# EAGLE design Cree 4x4 Led Panel (EAGLE 7.6.0)
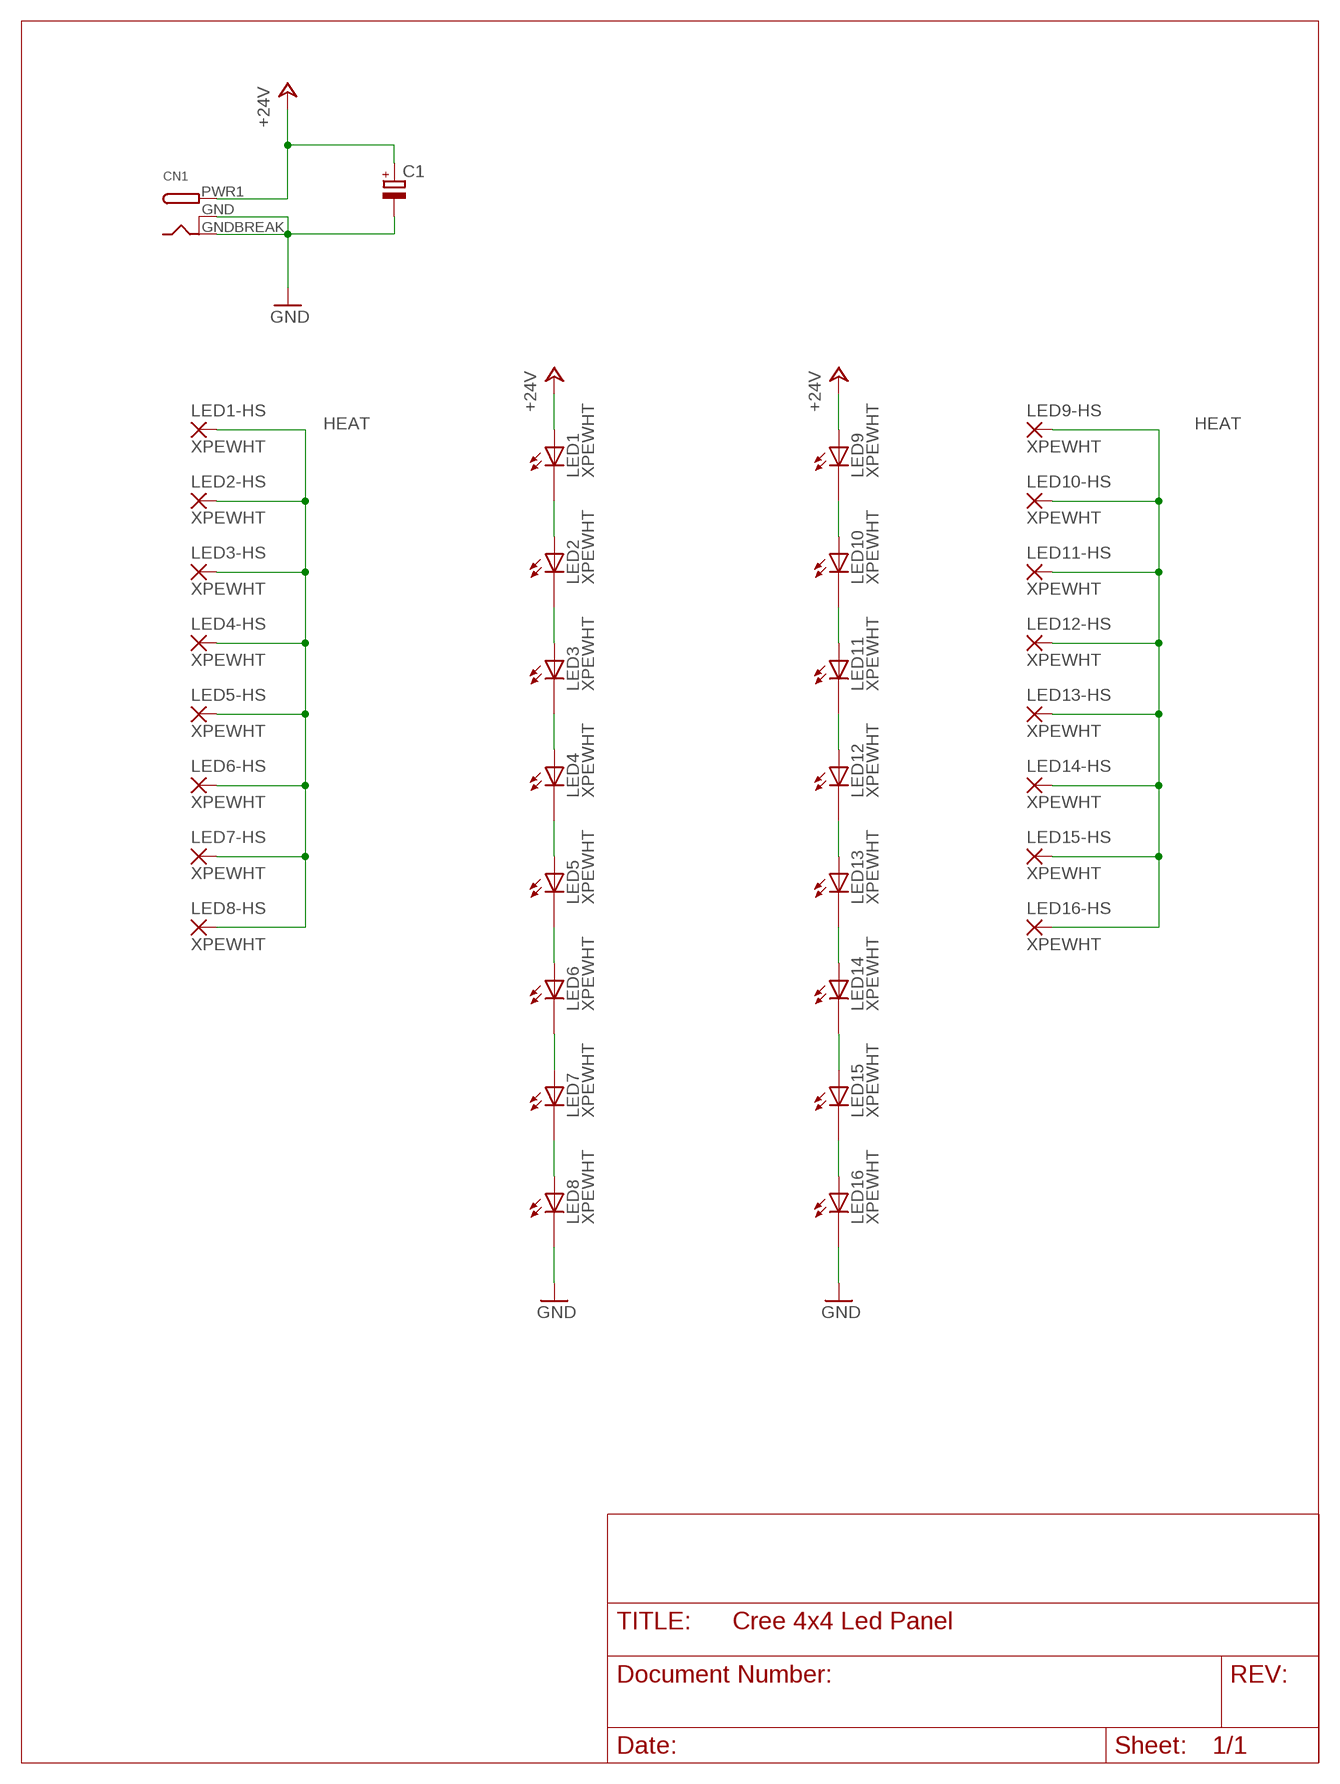
[diagram p0: schematic, sheet 1]

## Parts
C1  CPOL-EUSMCC  [SMC_C]
CN1  DCBARRELSMT  [DCJACK_2MM_SMT]
LED1  XPEWHT  XPEWHT-01-0000-00BC2  [CREE_XLAMP]
LED2  XPEWHT  XPEWHT-01-0000-00BC2  [CREE_XLAMP]
LED3  XPEWHT  XPEWHT-01-0000-00BC2  [CREE_XLAMP]
LED4  XPEWHT  XPEWHT-01-0000-00BC2  [CREE_XLAMP]
LED5  XPEWHT  XPEWHT-01-0000-00BC2  [CREE_XLAMP]
LED6  XPEWHT  XPEWHT-01-0000-00BC2  [CREE_XLAMP]
LED7  XPEWHT  XPEWHT-01-0000-00BC2  [CREE_XLAMP]
LED8  XPEWHT  XPEWHT-01-0000-00BC2  [CREE_XLAMP]
LED9  XPEWHT  XPEWHT-01-0000-00BC2  [CREE_XLAMP]
LED10  XPEWHT  XPEWHT-01-0000-00BC2  [CREE_XLAMP]
LED11  XPEWHT  XPEWHT-01-0000-00BC2  [CREE_XLAMP]
LED12  XPEWHT  XPEWHT-01-0000-00BC2  [CREE_XLAMP]
LED13  XPEWHT  XPEWHT-01-0000-00BC2  [CREE_XLAMP]
LED14  XPEWHT  XPEWHT-01-0000-00BC2  [CREE_XLAMP]
LED15  XPEWHT  XPEWHT-01-0000-00BC2  [CREE_XLAMP]
LED16  XPEWHT  XPEWHT-01-0000-00BC2  [CREE_XLAMP]

## Nets
+24V: C1.+ CN1.PWR1(PWR) LED1.A LED9.A
GND: C1.- CN1.GND(GNDBREAK) CN1.GNDBREAK(GND) LED8.C LED16.C
HEAT: LED1.X(P) LED2.X(P) LED3.X(P) LED4.X(P) LED5.X(P) LED6.X(P) LED7.X(P) LED8.X(P) LED9.X(P) LED10.X(P) LED11.X(P) LED12.X(P) LED13.X(P) LED14.X(P) LED15.X(P) LED16.X(P)
N$1: LED1.C LED2.A
N$2: LED2.C LED3.A
N$3: LED3.C LED4.A
N$4: LED5.C LED6.A
N$5: LED6.C LED7.A
N$6: LED9.C LED10.A
N$7: LED10.C LED11.A
N$8: LED7.C LED8.A
N$9: LED4.C LED5.A
N$10: LED11.C LED12.A
N$11: LED15.C LED16.A
N$12: LED12.C LED13.A
N$13: LED13.C LED14.A
N$14: LED14.C LED15.A
Unconnected: LED1.A@1(A) LED1.C@1(C) LED2.A@1(A) LED2.C@1(C) LED3.A@1(A) LED3.C@1(C) LED4.A@1(A) LED4.C@1(C) LED5.A@1(A) LED5.C@1(C) LED6.A@1(A) LED6.C@1(C) LED7.A@1(A) LED7.C@1(C) LED8.A@1(A) LED8.C@1(C) LED9.A@1(A) LED9.C@1(C) LED10.A@1(A) LED10.C@1(C) LED11.A@1(A) LED11.C@1(C) LED12.A@1(A) LED12.C@1(C) LED13.A@1(A) LED13.C@1(C) LED14.A@1(A) LED14.C@1(C) LED15.A@1(A) LED15.C@1(C) LED16.A@1(A) LED16.C@1(C)

## Library data of the parts
C1 = rcl:CPOL-EU: POLARIZED CAPACITOR, European symbol
CN1 = adafruit:DCBARREL: 2.0mm DC Barrel Jack DCJACK_2MM_PTH - Through Hole Jack (4UConnector: 05537)
LED1-LED16 = KippKitts:XPEWHT-: Cree® XLamp® XP-E LEDs Source: www.cree.com/xlamp .. XLampXP-E.pdf

## Board
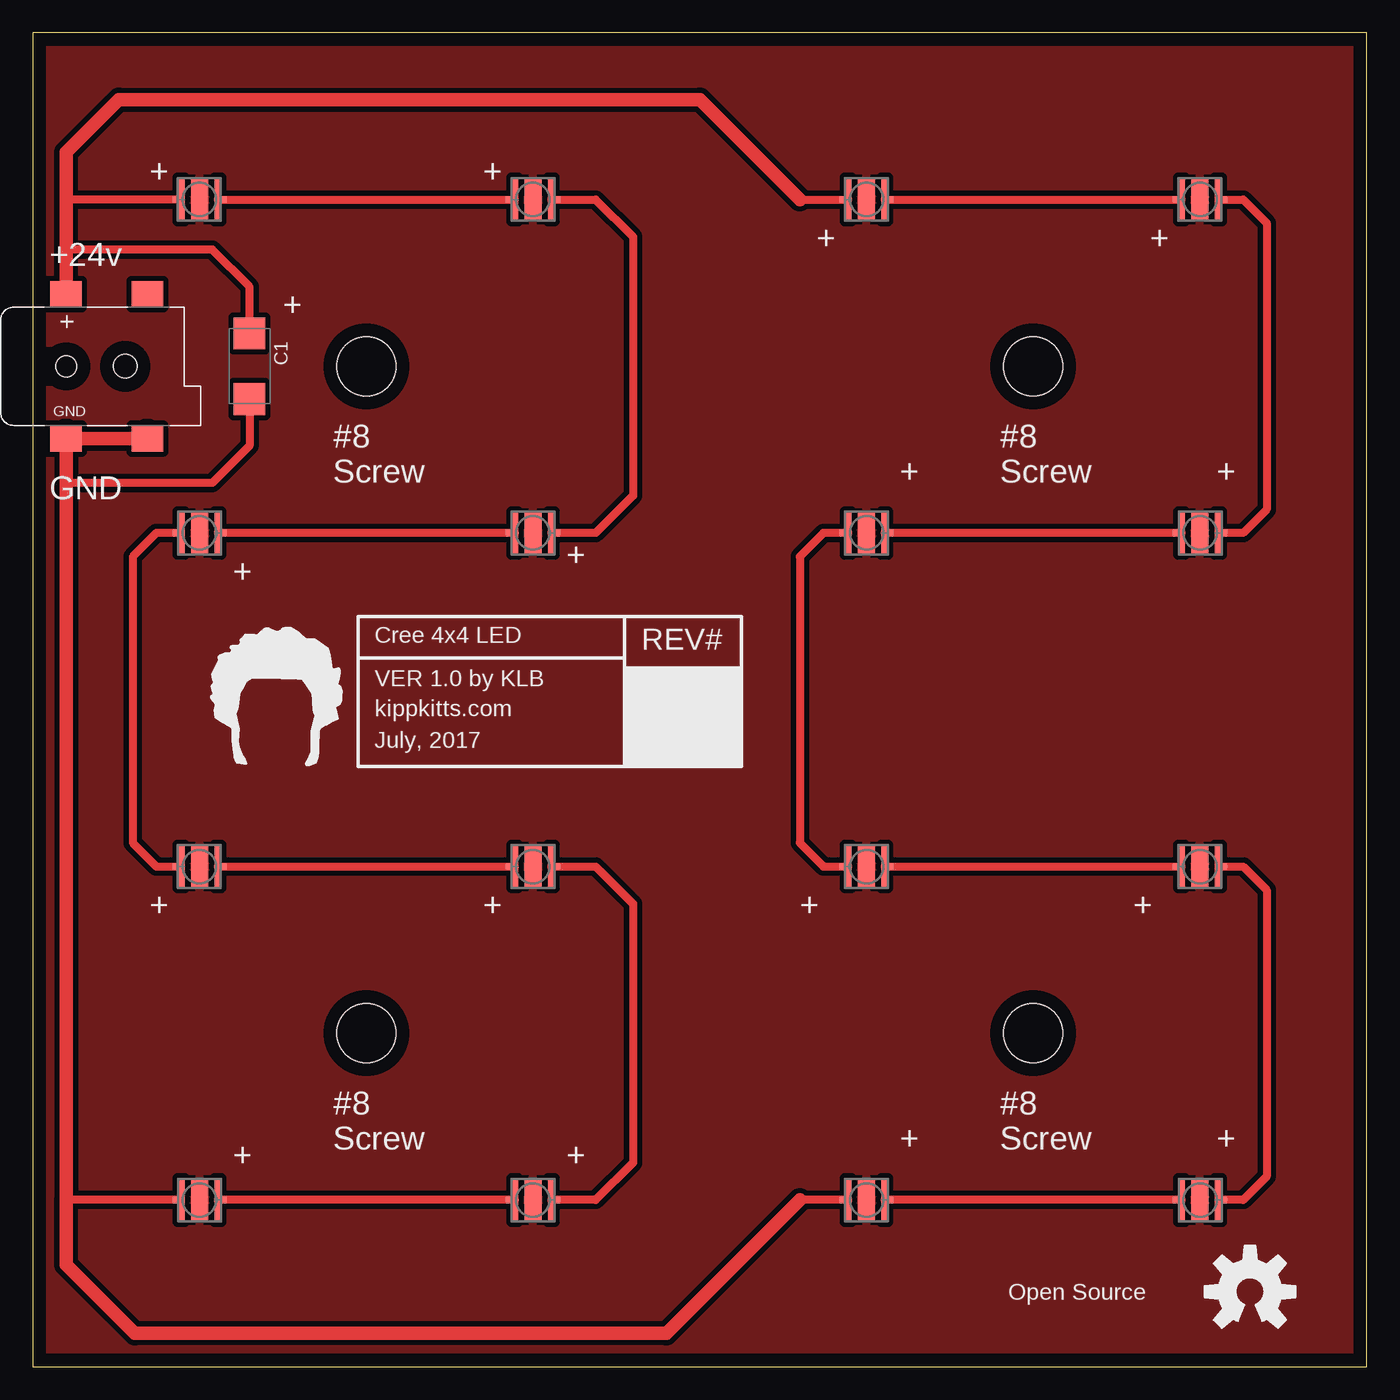
[diagram p1: board, top side]

Size 101.6 x 101.6 mm. Coordinates in mm from the lower left corner, seen from the top.
Outline: 0,0 101.6,0 101.6,101.6 0,101.6 0,0
Copper layers (1*16): Top 0.035mm / dielectric 1.5mm / Bottom 0.035mm
Design rules "default": minimum track width 10mil, minimum drill 24mil, track to track 8mil, track to pad 8mil, pad to pad 8mil, via to via 8mil, smd to smd 8mil, copper to edge 40mil, drill to drill 8mil, minimum pad ring 10mil, minimum via ring 8mil, stop-mask expansion 4mil, vias tented up to drill 0mil, thermal gap 10mil
Holes 4.5 mm at 25.4,76.2 76.2,76.2 76.2,25.4 25.4,25.4

### Footprints (pad centres in the part's own frame; a part is rotated, then mirrored left to right if it is on the bottom)
SMC_C = smd 2.4 x 2.4: + -2.5,0; - 2.5,0
DCJACK_2MM_SMT = smd 2.4 x 2: GND 0,-5.5; GNDBREAK 6.2,-5.5; PWR1 0,5.5; PWR2 6.2,5.5 | hole 1.6: 0,0 | hole 1.8: 4.5,0
CREE_XLAMP = smd 0.5 x 3.3: A -1.4,0; C 1.4,0 | smd 0.45 x 0.5: A@1 -1.825,0; C@1 1.825,0 | smd 1.3 x 3.3: X 0,0

### Placement (x,y rotation side)
C1  16.51,76.2 270 top
CN1  2.54,76.2 0 top
KKLOGO  [TOP_DOCU_10MM]  13.34,45.72 0 top
LED1  12.7,88.9 0 top
LED2  38.1,88.9 0 top
LED3  38.1,63.5 180 top
LED4  12.7,63.5 180 top
LED5  12.7,38.1 0 top
LED6  38.1,38.1 0 top
LED7  38.1,12.7 180 top
LED8  12.7,12.7 180 top
LED9  63.5,88.9 0 top
LED10  88.9,88.9 0 top
LED11  88.9,63.5 180 top
LED12  63.5,63.5 180 top
LED13  63.5,38.1 0 top
LED14  88.9,38.1 0 top
LED15  88.9,12.7 180 top
LED16  63.5,12.7 180 top
U$1  OSHW-LOGOL  [OSHW-LOGO-L]  92.71,5.71 0 top

### Tracks (layer width: path | path; a pad name or v marks a point on that pad's centre or on a via)
+24V
  Top 0.61: 58.42,88.9 LED9.A | LED1.A 2.54,88.9 | C1.+ 16.51,82.25 13.67,85.09 2.54,85.09
  Top 1.016: CN1.PWR1 2.54,85.09 2.54,88.9 2.54,92.5 6.56,96.52 50.8,96.52 58.42,88.9
GND
  Top 0.61: LED8.C 2.54,12.7 | LED16.C 58.42,12.7 | C1.- 16.51,70.15 13.67,67.31 2.54,67.31
  Top 1.016: 58.42,12.7 48.26,2.54 7.78,2.54 2.54,7.78 2.54,12.7 2.54,67.31 CN1.GND CN1.GNDBREAK
HEAT
  pour Top (isolate 0.406): -2.54,104.14 105.41,104.14 105.41,-2.54 -2.54,-2.54
N$1
  Top 0.61: LED1.C LED2.A
N$2
  Top 0.61: LED2.C 42.88,88.9 45.72,86.06 45.72,66.34 42.88,63.5 LED3.A
N$3
  Top 0.61: LED3.C LED4.A
N$4
  Top 0.61: LED5.C LED6.A
N$5
  Top 0.61: LED6.C 42.88,38.1 45.72,35.26 45.72,15.54 42.88,12.7 LED7.A
N$6
  Top 0.61: LED9.C LED10.A
N$7
  Top 0.61: LED10.C 92.18,88.9 93.98,87.1 93.98,65.3 92.18,63.5 LED11.A
N$8
  Top 0.61: LED7.C LED8.A
N$9
  Top 0.61: LED4.C 9.42,63.5 7.62,61.7 7.62,39.9 9.42,38.1 LED5.A
N$10
  Top 0.61: LED11.C LED12.A
N$11
  Top 0.61: LED15.C LED16.A
N$12
  Top 0.61: LED12.C 60.22,63.5 58.42,61.7 58.42,39.9 60.22,38.1 LED13.A
N$13
  Top 0.61: LED13.C LED14.A
N$14
  Top 0.61: LED14.C 92.18,38.1 93.98,36.3 93.98,14.5 92.18,12.7 LED15.A

### Text on the board
tPlace: + | Cree 4x4 LED | REV# | VER 1.0 by KLB | kippkitts.com | July, 2017 | Open Source
tNames: + | + | + | + | +24v | #8 / Screw | + | #8 / Screw | + | GND | + | + | + | + | + | + | #8 / Screw | + | #8 / Screw | + | + | +